# EAGLE design Beagle Cape (EAGLE 5.11)
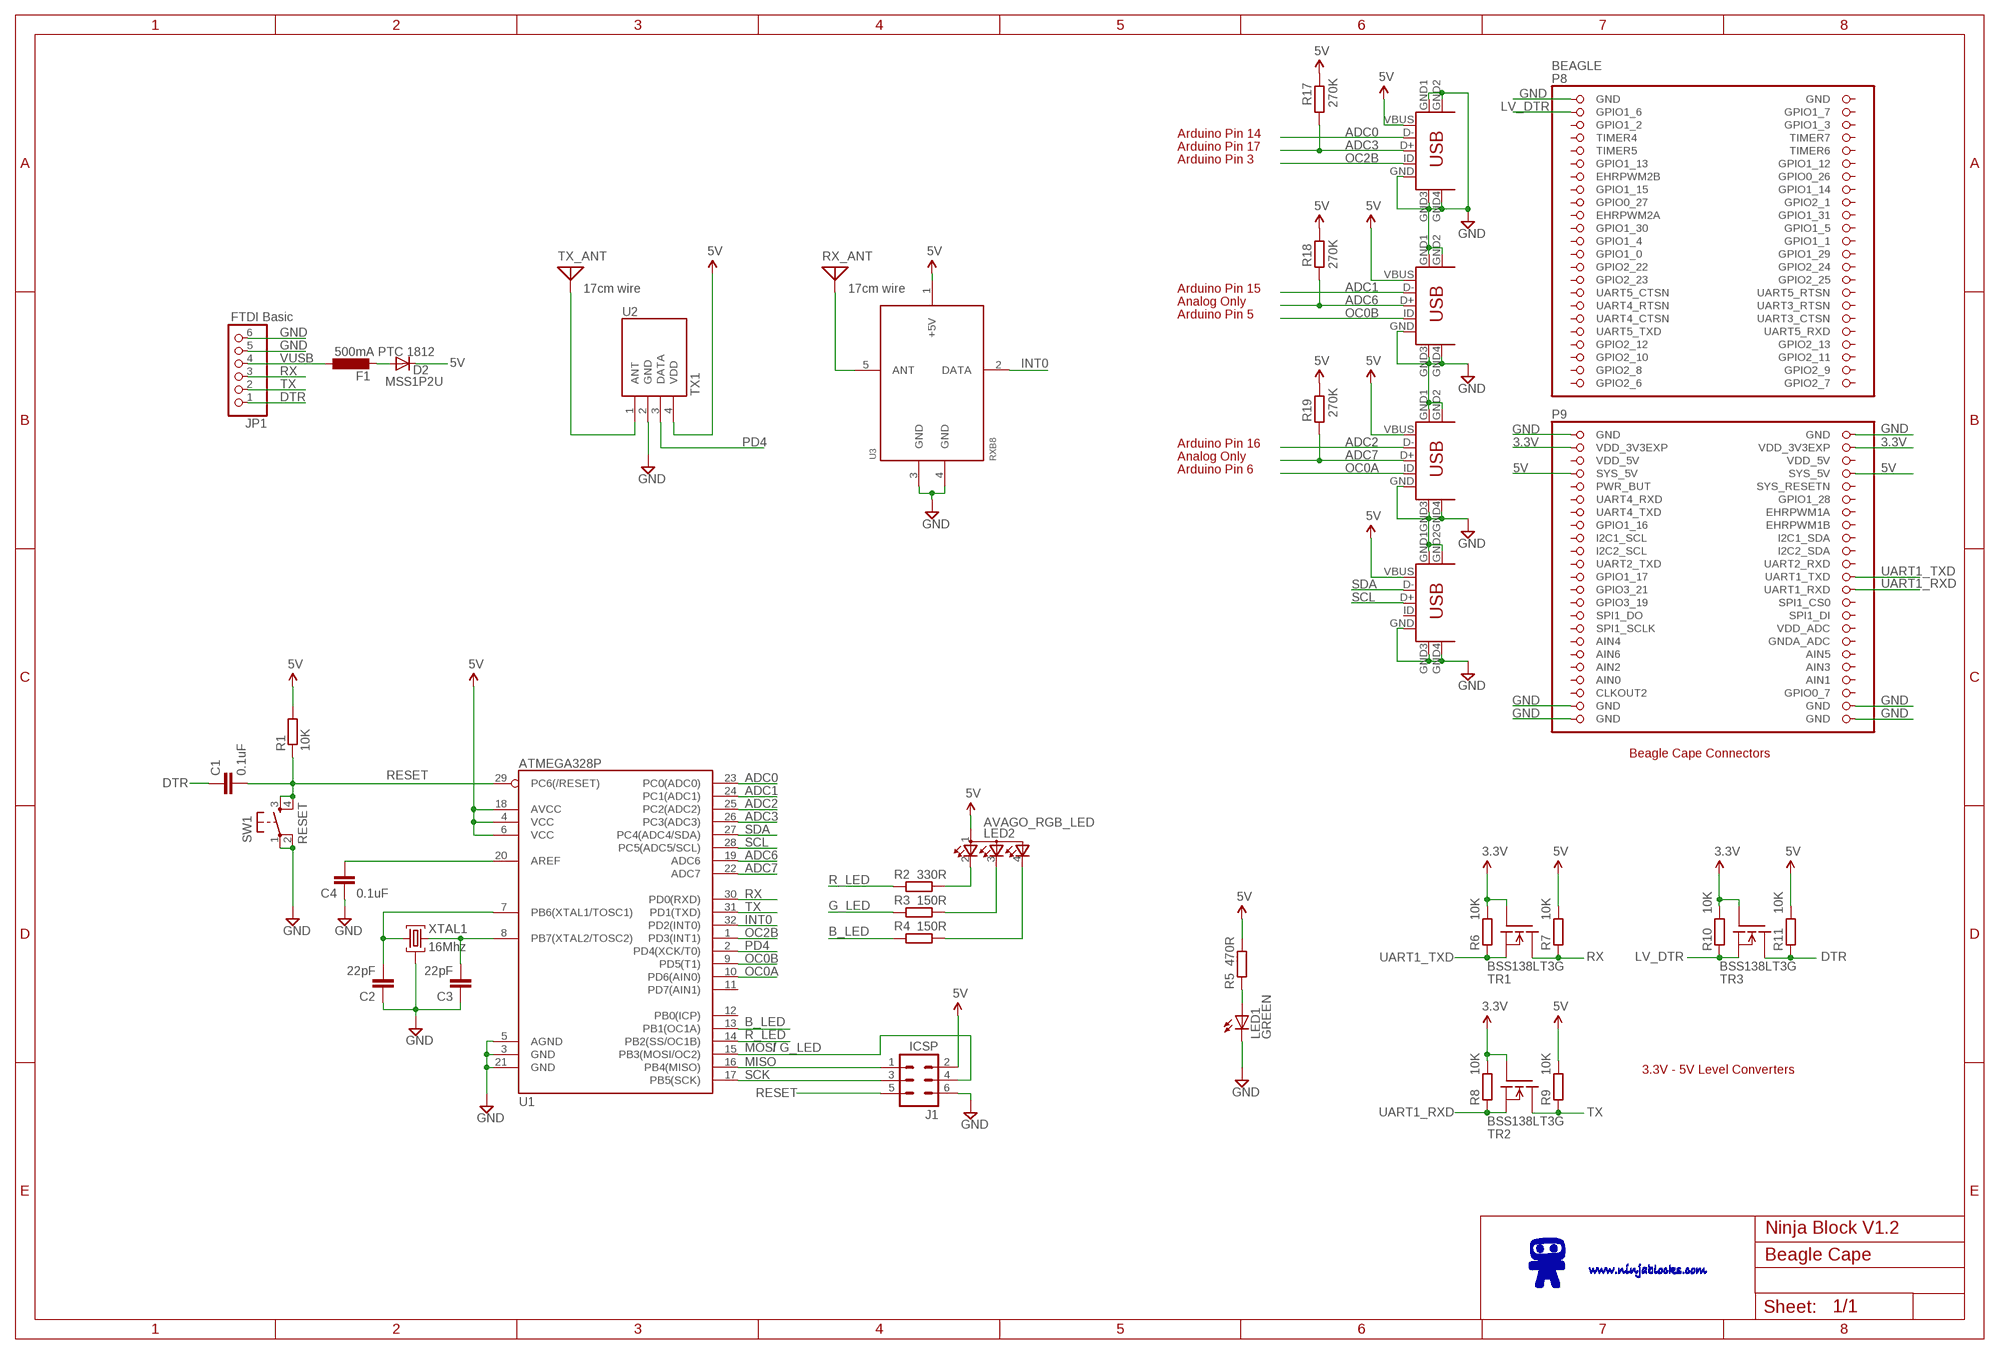
[diagram p0: schematic, sheet 1]

## Parts
BEAGLE  BEAGLEBONE_OUTLINE  [BEAGLEBONE_SHIELD]
C1  0.1uF  C-EUC0603  [C0603]
C2  22pF  C-EUC0603  [C0603]
C3  22pF  C-EUC0603  [C0603]
C4  0.1uF  C-EUC0603  [C0603]
CON1  USB-MINIB  [MOLEX_MINIUSB_B]
CON2  USB-MINIB  [MOLEX_MINIUSB_B]
CON3  USB-MINIB  [MOLEX_MINIUSB_B]
D2  MSS1P2U  [MICROSMP]
F1  500mA PTC 1812  L-EUL1812  [L1812]
I2C  USB-MINIB  [MOLEX_MINIUSB_B]
J1  ICSP  MA03-2  [MA03-2]
JP1  FTDI Basic  PINHD-1X6  [1X06]
LED1  GREEN  LEDCHIPLED_0603  [CHIPLED_0603]
LED2  AVAGO_RGB_LED  [AVAGO_LED]
R1  10K  R-EU_R0603  [R0603]
R2  330R  R-EU_R0603  [R0603]
R3  150R  R-EU_R0603  [R0603]
R4  150R  R-EU_R0603  [R0603]
R5  470R  R-EU_R0603  [R0603]
R6  10K  R-EU_R0603  [R0603]
R7  10K  R-EU_R0603  [R0603]
R8  10K  R-EU_R0603  [R0603]
R9  10K  R-EU_R0603  [R0603]
R10  10K  R-EU_R0603  [R0603]
R11  10K  R-EU_R0603  [R0603]
R17  270K  R-EU_R0603  [R0603]
R18  270K  R-EU_R0603  [R0603]
R19  270K  R-EU_R0603  [R0603]
RX_ANT  17cm wire  ANTENNA  [PAD-01]
SW1  RESET  ALPS_SMD_TAC_SWITCH  [ALPS_SMD_TAC_SWITCH]
TR1  BSS138LT3G  IRLML2502PBF  [SOT23]
TR2  BSS138LT3G  IRLML2502PBF  [SOT23]
TR3  BSS138LT3G  IRLML2502PBF  [SOT23]
TX_ANT  17cm wire  ANTENNA  [PAD-01]
U1  ATMEGA328P  ATMEGA168  [TQFP32-08]
U2  TX1  [TX1]
U3  RXB8  [RXB8]
XTAL1  16Mhz  12MHZ  [HC49US-G]

## Nets
3.3V: BEAGLE.49(VDD_3V3EXP) BEAGLE.50(VDD_3V3EXP) R6.1 R8.1 R10.1 TR1.1(G) TR2.1(G) TR3.1(G)
5V: BEAGLE.53(SYS_5V) BEAGLE.54(SYS_5V) CON1.VBUS CON2.VBUS CON3.VBUS D2.C I2C.VBUS J1.2 LED2.1(A1) R1.2 R5.1 R7.1 R9.1 R11.1 R17.1 R18.1 R19.1 U1.4(VCC) U1.6(VCC) U1.18(AVCC) U2.4(VDD) U3.1(+5V)
ADC0: CON1.D- U1.23(PC0(ADC0))
ADC1: CON2.D- U1.24(PC1(ADC1))
ADC2: CON3.D- U1.25(PC2(ADC2))
ADC3: CON1.D+ R17.2 U1.26(PC3(ADC3))
ADC6: CON2.D+ R18.2 U1.19(ADC6)
ADC7: CON3.D+ R19.2 U1.22(ADC7)
B_LED: R4.2 U1.13(PB1(OC1A))
DTR: C1.1 JP1.1 R11.2 TR3.3(D)
GND: BEAGLE.1(GND) BEAGLE.47(GND) BEAGLE.48(GND) BEAGLE.89(GND) BEAGLE.90(GND) BEAGLE.91(GND) BEAGLE.92(GND) C2.1 C3.1 C4.1 CON1.GND CON1.GND1(MTN1) CON1.GND2(MTN2) CON1.GND3(MTN3) CON1.GND4(MTN4) CON2.GND CON2.GND1(MTN1) CON2.GND2(MTN2) CON2.GND3(MTN3) CON2.GND4(MTN4) CON3.GND CON3.GND1(MTN1) CON3.GND2(MTN2) CON3.GND3(MTN3) CON3.GND4(MTN4) I2C.GND I2C.GND1(MTN1) I2C.GND2(MTN2) I2C.GND3(MTN3) I2C.GND4(MTN4) J1.6 JP1.5 JP1.6 LED1.C SW1.1 SW1.2 U1.3(GND) U1.5(AGND) U1.21(GND) U2.2(GND) U3.3(GND) U3.4(GND) XTAL1.GND
INT0: U1.32(PD2(INT0)) U3.2(DATA)
LV_DTR: BEAGLE.3(GPIO1_6) R10.2 TR3.2(S)
MISO: J1.1 U1.16(PB4(MISO))
MOSI: J1.4 R3.2 U1.15(PB3(MOSI/OC2))
N$1: C2.2 U1.7(PB6(XTAL1/TOSC1)) XTAL1.1
N$2: LED2.2(R2) R2.1
N$3: C3.2 U1.8(PB7(XTAL2/TOSC2)) XTAL1.2
N$4: C4.2 U1.20(AREF)
N$5: LED2.3(G3) R3.1
N$6: LED2.4(B4) R4.1
N$7: TX_ANT.1 U2.1(ANT)
N$8: RX_ANT.1 U3.5(ANT)
N$9: LED1.A R5.2
N$16: D2.A F1.2
OC0A: CON3.ID U1.10(PD6(AIN0))
OC0B: CON2.ID U1.9(PD5(T1))
OC2B: CON1.ID U1.1(PD3(INT1))
PD4: U1.2(PD4(XCK/T0)) U2.3(DATA)
R_LED: R2.2 U1.14(PB2(SS/OC1B))
RESET: C1.2 J1.5 R1.1 SW1.3 SW1.4 U1.29(PC6(/RESET))
RX: JP1.3 R7.2 TR1.3(D) U1.30(PD0(RXD))
SCK: J1.3 U1.17(PB5(SCK))
SCL: I2C.D+ U1.28(PC5(ADC5/SCL))
SDA: I2C.D- U1.27(PC4(ADC4/SDA))
TX: JP1.2 R9.2 TR2.3(D) U1.31(PD1(TXD))
UART1_RXD: BEAGLE.72(UART1_RXD) R8.2 TR2.2(S)
UART1_TXD: BEAGLE.70(UART1_TXD) R6.2 TR1.2(S)
VUSB: F1.1 JP1.4
Unconnected: BEAGLE.5(GPIO1_2) BEAGLE.6(GPIO1_3) BEAGLE.7(TIMER4) BEAGLE.8(TIMER7) BEAGLE.9(TIMER5) BEAGLE.10(TIMER6) BEAGLE.11(GPIO1_13) BEAGLE.12(GPIO1_12) BEAGLE.13(EHRPWM2B) BEAGLE.14(GPIO0_26) BEAGLE.15(GPIO1_15) BEAGLE.16(GPIO1_14) BEAGLE.17(GPIO0_27) BEAGLE.18(GPIO2_1) BEAGLE.19(EHRPWM2A) BEAGLE.20(GPIO1_31) BEAGLE.21(GPIO1_30) BEAGLE.22(GPIO1_5) BEAGLE.23(GPIO1_4) BEAGLE.24(GPIO1_1) BEAGLE.25(GPIO1_0) BEAGLE.26(GPIO1_29) BEAGLE.27(GPIO2_22) BEAGLE.28(GPIO2_24) BEAGLE.29(GPIO2_23) BEAGLE.30(GPIO2_25) BEAGLE.31(UART5_CTSN) BEAGLE.32(UART5_RTSN) BEAGLE.33(UART4_RTSN) BEAGLE.34(UART3_RTSN) BEAGLE.35(UART4_CTSN) BEAGLE.36(UART3_CTSN) BEAGLE.37(UART5_TXD) BEAGLE.38(UART5_RXD) BEAGLE.39(GPIO2_12) BEAGLE.40(GPIO2_13) BEAGLE.41(GPIO2_10) BEAGLE.55(PWR_BUT) BEAGLE.56(SYS_RESETN) BEAGLE.57(UART4_RXD) BEAGLE.58(GPIO1_28) BEAGLE.59(UART4_TXD) BEAGLE.60(EHRPWM1A) BEAGLE.61(GPIO1_16) BEAGLE.62(EHRPWM1B) BEAGLE.63(I2C1_SCL) BEAGLE.64(I2C1_SDA) BEAGLE.65(I2C2_SCL) BEAGLE.66(I2C2_SDA) BEAGLE.67(UART2_TXD) BEAGLE.68(UART2_RXD) BEAGLE.69(GPIO1_17) BEAGLE.71(GPIO3_21) BEAGLE.73(GPIO3_19) BEAGLE.74(SPI1_CS0) BEAGLE.75(SPI1_DO) BEAGLE.76(SPI1_DI) BEAGLE.77(SPI1_SCLK) BEAGLE.78(VDD_ADC) BEAGLE.79(AIN4) BEAGLE.80(GNDA_ADC) BEAGLE.81(AIN6) BEAGLE.82(AIN5) BEAGLE.83(AIN2) BEAGLE.86(AIN1) BEAGLE.87(CLKOUT2) BEAGLE.88(GPIO0_7) I2C.ID U1.11(PD7(AIN1)) U1.12(PB0(ICP))

## Notes on the sheet
- Arduino Pin 14
- Arduino Pin 17
- Arduino Pin 3
- Arduino Pin 15
- Analog Only
- Arduino Pin 5
- Arduino Pin 16
- Analog Only
- Arduino Pin 6
- Beagle Cape Connectors
- G_LED
- / G_LED
- 3.3V - 5V Level Converters
- Ninja Block V1.2

## Power pins joined to a net without a drawn wire
AIN0: BEAGLE.85(AIN0)
AIN3: BEAGLE.84(AIN3)
GND: BEAGLE.2(GND)
GPIO1_7: BEAGLE.4(GPIO1_7)
GPIO2_6: BEAGLE.45(GPIO2_6)
GPIO2_7: BEAGLE.46(GPIO2_7)
GPIO2_8: BEAGLE.43(GPIO2_8)
GPIO2_9: BEAGLE.44(GPIO2_9)
GPIO2_11: BEAGLE.42(GPIO2_11)
VDD_5V: BEAGLE.51(VDD_5V) BEAGLE.52(VDD_5V)

## Library data of the parts
BEAGLE = adafruit:BEAGLEBONE_OUTLINE: Should match A3 pinout - but not completely tested
C1-C4 = rcl:C-EU: CAPACITOR, European symbol
CON1-CON3 I2C = SparkFun:USB-MINIB: Mini-USB "B" connector with 5th pin broken out. Created new symbol breaking out 5th "ID" pin in mini/micro USB connector spec. See: http://en.wikipedia.org/wiki/Mini_usb#Cables. Uses same footprint as 4-pin symbol. Also added pins to connect to mounting / shield pads if required (probably not generally needed as signals aren't shielded once they leave the connector).
D2 = Monkey:MSS1P2U: MSS1P2U-M3/89A Schottky Rectifier Datasheet : http://www.vishay.com/docs/89020/mss1p3l.pdf
F1 = rcl:L-EU: INDUCTOR, European symbol
J1 = con-lstb:MA03-2: PIN HEADER; OC_FARNELL: unknown; OC_NEWARK: unknown
JP1 = pinhead:PINHD-1X6: PIN HEADER
LED1 = led:LED: LED OSRAM: - CHIPLED LG R971, LG N971, LY N971, LG Q971, LY Q971, LO R971, LY R971 LH N974, LH R974 LS Q976, LO Q976, LY Q976 LO Q996 - Hyper CHIPLED LW Q18S LB Q993, LB Q99A, LB R99A - SideLED LS A670, LO A670, LY A670, LG A670, LP A670 LB A673, LV A673, LT A673, LW A673 LH A674 LY A675 LS A676, LA A676, LO A676, LY A676, LW A676 LS A679, LY A679, LG A679 - Hyper Micro SIDELED® LS Y876, LA Y876, LO Y876, LY Y876 LT Y87S - SmartLED LW L88C, LW L88S LB L89C, LB L89S, LG L890 LS L89K, LO L89K, LY L89K LS L896, LA L896, LO L896, LY L896 - TOPLED LS T670, LO T670, LY T670, LG T670, LP T670 LSG T670, LSP T670, LSY T670, LOP T670, LYG T670 LG T671, LOG T671, LSG T671 LB T673, LV T673, LT T673, LW T673 LH T674 LS T676, LA T676, LO T676, LY T676, LB T676, LH T676, LSB T676, LW T676 LB T67C, LV T67C, LT T67C, LS T67K, LO T67K, LY T67K, LW E67C LS E67B, LA E67B, LO E67B, LY E67B, LB E67C, LV E67C, LT E67C LW T67C LS T679, LY T679, LG T679 LS T770, LO T770, LY T770, LG T770, LP T770 LB T773, LV T773, LT T773, LW T773 LH T774 LS E675, LA E675, LY E675, LS T675 LS T776, LA T776, LO T776, LY T776, LB T776 LHGB T686 LT T68C, LB T68C - Hyper Mini TOPLED® LB M676 - Mini TOPLED Santana® LG M470 LS M47K, LO M47K, LY M47K Source: http://www.osram.convergy.de LUXEON: - LUMILED® LXK2-PW12-R00, LXK2-PW12-S00, LXK2-PW14-U00, LXK2-PW14-V00 LXK2-PM12-R00, LXK2-PM12-S00, LXK2-PM14-U00 LXK2-PE12-Q00, LXK2-PE12-R00, LXK2-PE12-S00, LXK2-PE14-T00, LXK2-PE14-U00 LXK2-PB12-K00, LXK2-PB12-L00, LXK2-PB12-M00, LXK2-PB14-N00, LXK2-PB14-P00, LXK2-PB14-Q00 LXK2-PR12-L00, LXK2-PR12-M00, LXK2-PR14-Q00, LXK2-PR14-R00 LXK2-PD12-Q00, LXK2-PD12-R00, LXK2-PD12-S00 LXK2-PH12-R00, LXK2-PH12-S00 LXK2-PL12-P00, LXK2-PL12-Q00, LXK2-PL12-R00 Source: www.luxeon.com KINGBRIGHT: KA-3528ASYC Source: www.kingbright.com
LED2 = Monkey:AVAGO_RGB_LED
R1-R11 R17-R19 = resistor:R-EU_: RESISTOR, European symbol
RX_ANT TX_ANT = discrete:ANTENNA: Antenna
SW1 = Monkey:ALPS_SMD_TAC_SWITCH: ALPS SMD Tactile Switch SKQGAKE010 Source : http://www.farnell.com/datasheets/78970.pdf
TR1-TR3 = Monkey:IRLML2502PBF: IRLML2502 N-Channel HexFet Power Mosfet Datasheet : http://www.irf.com/product-info/datasheets/data/irlml2502pbf.pdf
U1 = SparkFun:ATMEGA168
U2 = ninja:TX1
U3 = ninja:RXB8: RY-RXB8 ASK Receiving module http://www.relyrf.com/rf/ask_receiver/RY-RXB8.htm
XTAL1 = Monkey:12MHZ: HC/49US (AT49) 3RD LEAD CASE-GROUNDED SMD LOW PROFILE CRYSTAL CRYSTAL, 12MHz, 18pF, HC-49/US Source : http://www.abracon.com/Resonators/ABLSG.pdf

## Board
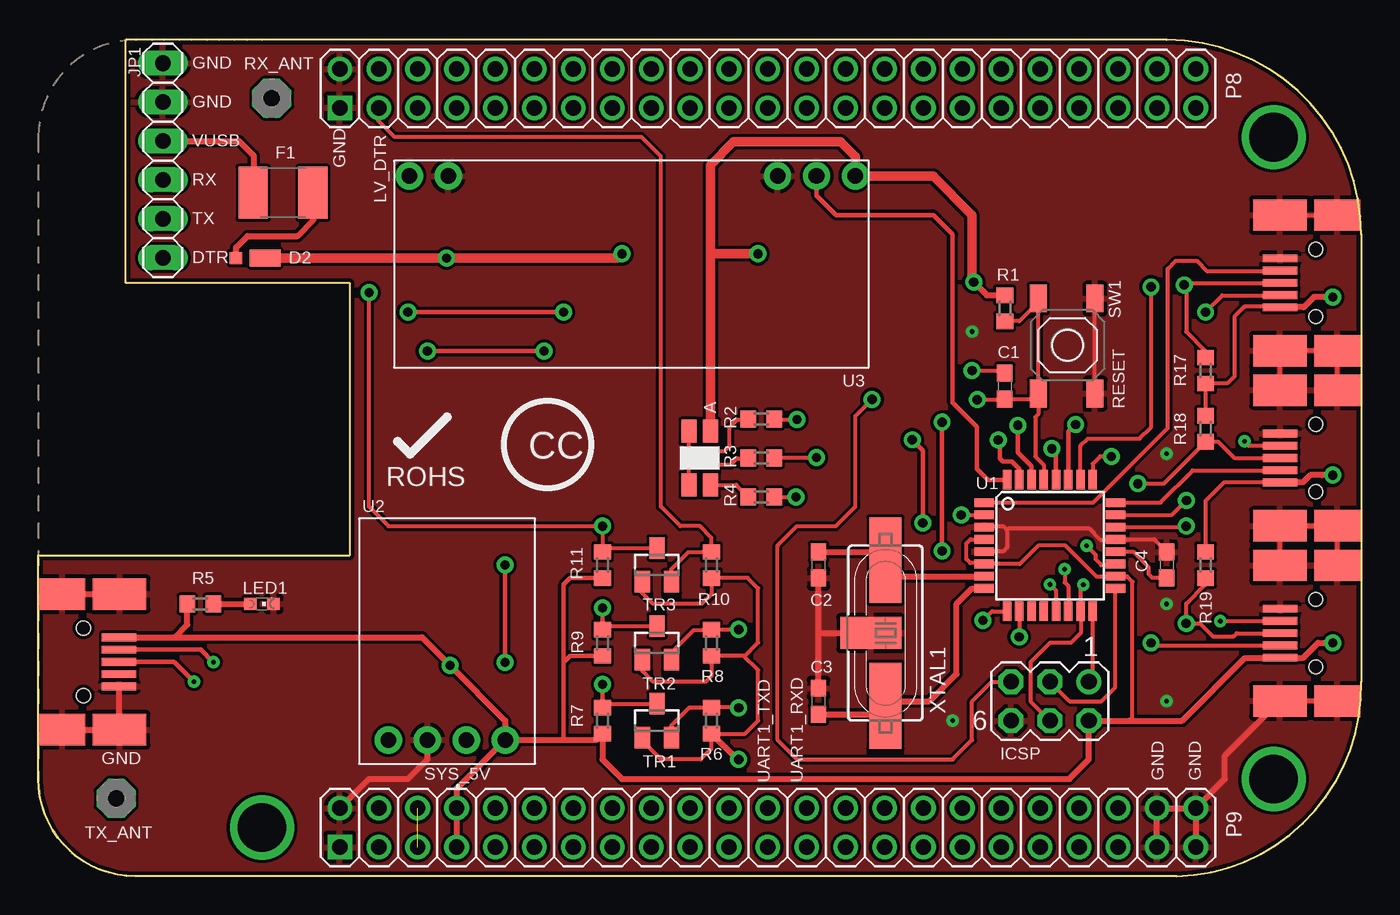
[diagram p1: board, top side]
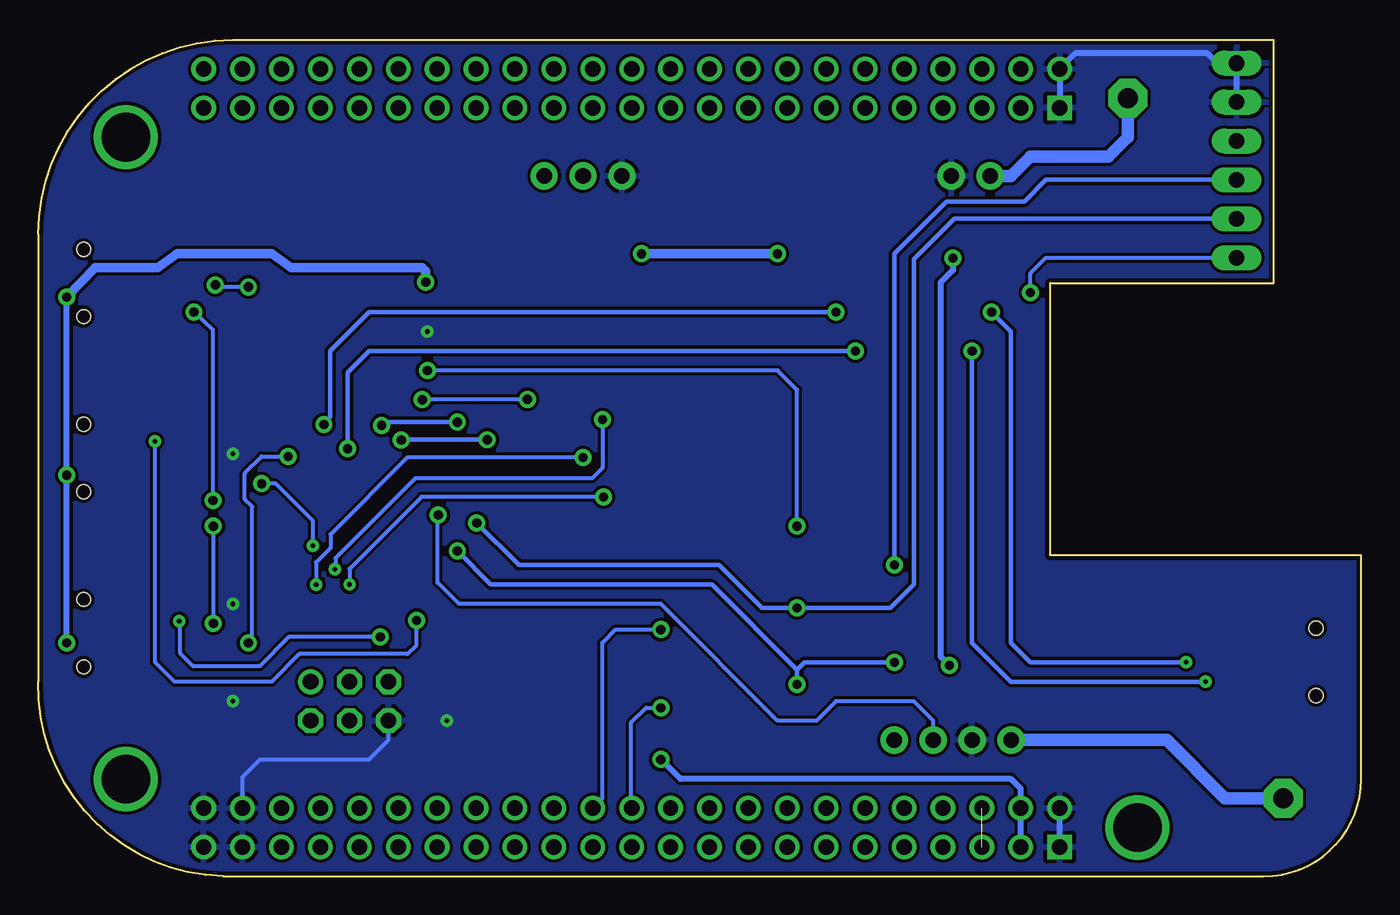
[diagram p2: board, bottom side, seen from below]

Size 86.36 x 54.61 mm. Coordinates in mm from the lower left corner, seen from the top.
Copper layers (1*16): Top 0.035mm / dielectric 1.5mm / Bottom 0.035mm
Design rules "SparkFun": minimum track width 8mil, minimum drill 20mil, track to track 8mil, track to pad 8mil, pad to pad 8mil, via to via 8mil, smd to smd 8mil, copper to edge 10mil, drill to drill 8mil, minimum pad ring 12mil, minimum via ring 10mil, stop-mask expansion 4mil, vias tented up to drill 25mil, thermal gap 10mil

### Footprints (pad centres in the part's own frame; a part is rotated, then mirrored left to right if it is on the bottom)
BEAGLEBONE_SHIELD = drill 1 square: 1 19.685,50.165; 47 19.685,1.905 | drill 1 round: 2 19.685,52.705; 3 22.225,50.165; 4 22.225,52.705; 5 24.765,50.165; 6 24.765,52.705; 7 27.305,50.165; 8 27.305,52.705; 9 29.845,50.165; 10 29.845,52.705; 11 32.385,50.165; 12 32.385,52.705; 13 34.925,50.165; 14 34.925,52.705; 15 37.465,50.165; 16 37.465,52.705; 17 40.005,50.165; 18 40.005,52.705; 19 42.545,50.165; 20 42.545,52.705; 21 45.085,50.165; 22 45.085,52.705; 23 47.625,50.165; 24 47.625,52.705; 25 50.165,50.165; 26 50.165,52.705; 27 52.705,50.165; 28 52.705,52.705; 29 55.245,50.165; 30 55.245,52.705; 31 57.785,50.165; 32 57.785,52.705; 33 60.325,50.165; 34 60.325,52.705; 35 62.865,50.165; 36 62.865,52.705; 37 65.405,50.165; 38 65.405,52.705; 39 67.945,50.165; 40 67.945,52.705; 41 70.485,50.165; 42 70.485,52.705; 43 73.025,50.165; 44 73.025,52.705; 45 75.565,50.165; 46 75.565,52.705; 48 19.685,4.445; 49 22.225,1.905; 50 22.225,4.445; 51 24.765,1.905; 52 24.765,4.445; 53 27.305,1.905; 54 27.305,4.445; 55 29.845,1.905; 56 29.845,4.445; 57 32.385,1.905; 58 32.385,4.445; 59 34.925,1.905; 60 34.925,4.445; 61 37.465,1.905; 62 37.465,4.445; 63 40.005,1.905; 64 40.005,4.445; 65 42.545,1.905; 66 42.545,4.445; 67 45.085,1.905; 68 45.085,4.445; 69 47.625,1.905; 70 47.625,4.445; 71 50.165,1.905; 72 50.165,4.445; 73 52.705,1.905; 74 52.705,4.445; 75 55.245,1.905; 76 55.245,4.445; 77 57.785,1.905; 78 57.785,4.445; 79 60.325,1.905; 80 60.325,4.445; 81 62.865,1.905; 82 62.865,4.445; 83 65.405,1.905; 84 65.405,4.445; 85 67.945,1.905; 86 67.945,4.445; 87 70.485,1.905; 88 70.485,4.445; 89 73.025,1.905; 90 73.025,4.445; 91 75.565,1.905; 92 75.565,4.445 | drill 3.175 round: P$1 14.605,3.175; P$2 80.645,6.35; P$3 80.645,48.26
C0603 = smd 1.1 x 1: 1 -0.85,0; 2 0.85,0
MOLEX_MINIUSB_B = smd 2.25 x 0.5: D+ 2.325,-0.005; D- 2.325,0.795; GND 2.325,-1.605; ID 2.325,-0.805; VBUS 2.325,1.595 | smd 3 x 2.05: GND1 -1.4,-4.43; GND3 -1.4,4.42 | smd 3.5 x 2.05: GND2 2.35,-4.43; GND4 2.35,4.42 | hole 0.9: 0,-2.205; 0,2.195
MICROSMP = smd 0.8 x 0.8: A 1.9,0 | smd 2 x 1.1: C 0,0
L1812 = smd 1.9 x 3.4: 1 -1.95,0; 2 1.95,0
MA03-2 = drill 1.016 round: 1 -2.54,-1.27 | drill 1.016 octagon: 2 -2.54,1.27; 3 0,-1.27; 4 0,1.27; 5 2.54,-1.27; 6 2.54,1.27
1X06 = drill 1.016 long: 1 -6.35,0; 2 -3.81,0; 3 -1.27,0; 4 1.27,0; 5 3.81,0; 6 6.35,0
CHIPLED_0603 = smd 0.8 x 0.8: A 0,-0.75; C 0,0.75
AVAGO_LED = smd 1.5 x 1: 1 1.75,-0.7; 2 1.75,0.7; 3 -1.75,0.7; 4 -1.75,-0.7
R0603 = smd 1 x 1.1: 1 -0.85,0; 2 0.85,0
PAD-01 = drill 1.321 pad 2.54 octagon: 1 0,0
ALPS_SMD_TAC_SWITCH = smd 1.8 x 1.1: 1 0,3.7; 2 6.2,3.7; 3 0,0; 4 6.2,0
SOT23 = smd 1 x 1.4: 1 -0.95,-1.1; 2 0.95,-1.1; 3 0,1.1
TQFP32-08 = smd 1.27 x 0.559: 1 -4.293,2.8; 2 -4.293,2; 3 -4.293,1.2; 4 -4.293,0.4; 5 -4.293,-0.4; 6 -4.293,-1.2; 7 -4.293,-2; 8 -4.293,-2.8; 17 4.293,-2.8; 18 4.293,-2; 19 4.293,-1.2; 20 4.293,-0.4; 21 4.293,0.4; 22 4.293,1.2; 23 4.293,2; 24 4.293,2.8 | smd 0.559 x 1.27: 9 -2.8,-4.293; 10 -2,-4.293; 11 -1.2,-4.293; 12 -0.4,-4.293; 13 0.4,-4.293; 14 1.2,-4.293; 15 2,-4.293; 16 2.8,-4.293; 25 2.8,4.293; 26 2,4.293; 27 1.2,4.293; 28 0.4,4.293; 29 -0.4,4.293; 30 -1.2,4.293; 31 -2,4.293; 32 -2.8,4.293
TX1 = drill 1.016 pad 1.778 round: 1 0,0; 2 2.54,0; 3 5.08,0; 4 7.62,0
RXB8 = drill 1.016 pad 1.778 round: 1 -24.13,0; 2 -21.59,0; 3 -19.05,0; 4 2.45,0; 5 4.99,0
HC49US-G = smd 5.6 x 2.1: 1 -11.74,0.95; 2 -2.24,0.95 | smd 2.1 x 4: GND -6.99,0

### Placement (x,y rotation side)
BEAGLE  0,0 0 top
C1  63.09,32 270 top
C2  50.93,20.32 90 top
C3  50.93,11.43 270 top
C4  73.66,20.32 270 top
CON1  83.4,38.73 180 top
CON2  83.4,27.3 180 top
CON3  83.4,15.87 180 top
D2  14.81,40.36 180 top
F1  15.98,44.63 0 top
I2C  2.95,14 0 top
J1  66.04,11.43 180 top
JP1  8.13,46.74 90 top
LED1  14.61,17.78 270 top
LED2  43.18,27.3 90 top
R1  63.09,37.08 90 top
R2  47.19,29.84 0 top
R3  47.19,27.3 0 top
R4  47.19,24.77 0 top
R5  10.58,17.78 0 top
R6  43.94,10.16 90 top
R7  36.83,10.16 90 top
R8  43.94,15.24 90 top
R9  36.83,15.24 90 top
R10  43.94,20.32 90 top
R11  36.83,20.32 90 top
R17  76.2,33.02 90 top
R18  76.2,29.21 270 top
R19  76.2,20.32 270 top
RX_ANT  15.24,50.8 0 top
SW1  65.28,37.72 270 top
TR1  40.39,10.16 0 top
TR2  40.39,15.24 0 top
TR3  40.39,20.32 0 top
TX_ANT  5.08,5.08 0 top
U1  66.04,21.59 0 top
U2  22.86,8.89 0 top
U3  29.21,45.72 180 top
XTAL1  54.36,8.89 270 top

### Tracks (layer width: path | path; a pad name or v marks a point on that pad's centre or on a via)
3.3V  (via drill 0.6)
  Top 0.254: TR3.1 39.44,19.12 39.37,19.05 39.37,18.54 40.13,17.78 43.31,17.78 43.94,18.41 R10.1 43.95,19.48 46.3,19.48 46.99,18.8 46.99,15.27 46.13,14.4 46.05,14.4 | TR2.1 39.44,13.4 40.13,12.7 43.56,12.7 43.94,13.08 43.94,13.89 44.45,14.4 | TR1.1 39.44,8.82 40.64,7.62 43.23,7.62 43.92,8.31 43.92,9.29 R6.1 46.14,9.31 46.99,10.16 46.99,13.46 46.05,14.4 | 46.05,14.4 44.45,14.4 | 44.45,14.4 43.95,14.4 R8.1
  Top 0.406: v45.72,7.62 45.63,7.62 R6.1
  Bottom 0.406: BEAGLE.49 BEAGLE.50 22.23,5.71 22.86,6.35 44.45,6.35 v45.72,7.62
5V  (via drill 0.6)
  Top 0.254: U1.4 60.85,21.99 60.58,21.72 60.58,20.7 60.83,20.45 61.69,20.45 U1.6 64.08,20.39 65.28,21.59 67.06,21.59 69.09,19.56 70.3,19.56 U1.18 71.07,19.58 71.42,19.23 71.42,10.21 71.2,10.16 | CON1.VBUS | CON1.VBUS | v61.06,38.79 60.96,38.89 | R18.1 R17.1 77.61,32.17 78.08,32.64 78.08,36.52 78.74,37.19 81.03,37.19 CON1.VBUS | CON2.VBUS 77.39,25.7 76.2,24.51 R19.1
  Top 0.305: R11.1 34.71,19.47 34.29,19.05 34.29,13.97 | 34.29,8.89 34.29,13.97 | R9.1 34.71,14.39 34.29,13.97
  Top 0.406: BEAGLE.53 BEAGLE.54 27.3,5.71 U2.4 | 81.13,25.7 CON2.VBUS 82.56,25.71 83.04,26.19 83.79,26.19 v84.5,26.19 | CON1.VBUS 81.05,37.13 | R1.2 61.91,37.93 v61.06,38.79 | v84.5,37.82 83.27,37.82 82.6,37.15 CON1.VBUS | v84.5,15.24 83.55,15.24 82.58,14.27 CON3.VBUS 81.05,14.25 78.77,14.25 74.68,10.16 71.2,10.16 J1.2 68.58,7.62 67.31,6.35 38.1,6.35 36.83,7.62 R7.1 36.41,8.89 34.29,8.89 U2.4 | I2C.VBUS 8.89,15.6 | 8.89,15.6 25.05,15.6 v26.87,13.77 | v26.87,13.77 30.48,10.16 U2.4 | R5.1 9.73,16.43 8.89,15.6 | 26.9,13.79 v26.87,13.77
  Top 0.61: 60.96,38.89 60.96,43.18 58.42,45.72 U3.1 53.34,46.99 52.35,47.95 45.39,47.95 43.88,46.42 43.88,40.64 | 43.88,40.64 LED2.1 | D2.C v26.64,40.36 37.82,40.36 v38.1,40.64 | 43.88,40.64 v46.99,40.64
  Bottom 0.406: v84.5,37.82 v84.5,26.19 v84.5,15.24 | v26.64,40.36 26.64,39.57 27.46,38.76 27.46,14.35 26.9,13.79
  Bottom 0.61: v61.06,38.79 61.06,39.5 61.29,39.73 69.85,39.73 71.12,40.64 77.29,40.64 78.56,39.73 82.65,39.73 v84.5,37.82 | v46.99,40.64 v38.1,40.64
ADC0  (via drill 0.6)
  Top 0.254: U1.23 74.01,23.59 v74.95,24.54 | CON1.D- 81.06,37.92 77.29,37.92 v76.2,36.83
  Bottom 0.254: v74.95,24.54 74.95,35.66 v76.2,36.83
ADC1
  Top 0.254: U1.24 73.26,24.39 75.36,26.49 81.06,26.49 CON2.D-
ADC2  (via drill 0.6)
  Top 0.254: v70.05,27.41 69.32,27.41 68.83,26.92 U1.25 | CON3.D- 72.81,15.07 v72.64,15.24
  Bottom 0.254: v70.05,27.41 71.78,27.41 72.87,26.31 72.87,24.61 72.39,24.13 72.39,15.49 v72.64,15.24
ADC3  (via drill 0.6)
  Top 0.254: v72.64,38.48 72.64,29.34 71.88,28.57 68.5,28.57 68.04,28.11 U1.26 | CON1.D+ 74.94,38.74 v74.8,38.61 74.93,38.48 74.93,35.56 76.2,34.29 R17.2
  Bottom 0.254: v72.64,38.48 74.68,38.48 v74.8,38.61
ADC6  (via drill 0.3, 0.6)
  Top 0.254: R18.2 76.22,28.34 | R18.2 76.17,28.34 | R18.2 76.19,28.37 | U1.19 69.92,20.39 69.85,20.32 69.39,20.32 69.01,20.7 69.01,21.01 v68.43,21.59 | v71.78,25.63 73.47,25.63 R18.2 | CON2.D+ 78.08,27.31 77.01,28.37 76.21,28.37 R18.2
  Bottom 0.254: v68.43,21.59 68.43,23.19 70.87,25.63 v71.78,25.63
ADC7  (via drill 0.6)
  Top 0.254: CON3.D+ 78.23,15.87 78.03,15.67 76.66,15.67 75.82,16.51 v74.93,16.51 74.93,17.78 76.2,19.05 R19.2 | U1.22 74.86,22.79 v74.93,22.86
  Bottom 0.254: v74.93,22.86 v74.93,16.51
B_LED  (via drill 0.3, 0.6)
  Top 0.254: U1.13 66.44,18.65 v66.04,19.05 | R4.2 v49.45,24.77
  Bottom 0.254: v49.45,24.77 61.34,24.77 66.04,20.07 v66.04,19.05
DTR  (via drill 0.6)
  Top 0.254: TR3.3 37.08,21.42 R11.2 v36.83,22.86 22.86,22.86 21.59,24.13 v21.59,38.1 | v60.96,33.02 62.93,33.02 C1.1
  Bottom 0.254: v36.83,22.86 36.83,31.75 38.1,33.02 v60.96,33.02 | JP1.1 20.57,40.39 21.59,39.37 v21.59,38.1
GND  (via drill 0.3)
  Top 0.254: SW1.2 SW1.1 | U1.3 62.16,22.79 62.23,22.86 62.99,22.86 63.25,22.61 | 63.25,22.61 63.25,21.46 62.99,21.21 61.77,21.21 U1.5 | 63.25,22.61 63.37,22.73 68.58,22.73 69.34,21.97 70.31,21.97 U1.21 72.84,21.99 C4.1 | CON1.GND2 CON1.GND1
  Top 0.305: CON3.GND2 CON2.GND4 CON2.GND3 CON3.GND1 | CON3.GND4 CON3.GND3 | CON2.GND1 CON1.GND3 CON1.GND4 CON2.GND2
  Top 0.406: C3.1 50.93,15.88 | 50.93,15.88 C2.1 | XTAL1.GND 50.93,15.88 | BEAGLE.89 BEAGLE.90 BEAGLE.92 | BEAGLE.92 BEAGLE.91 | I2C.GND1 I2C.GND2 5.28,9.57 I2C.GND 5.25,12.38 | I2C.GND3 I2C.GND4 | BEAGLE.92 77.47,6.35 77.47,7.87 CON3.GND4 | U2.2 25.4,7.62 24.13,6.35 21.59,6.35 BEAGLE.48
  Bottom 0.254: J1.6 63.5,8.89 64.77,7.62 71.88,7.62 73.03,6.48 BEAGLE.90
  Bottom 0.406: BEAGLE.47 BEAGLE.48 | BEAGLE.1 BEAGLE.2 18.67,53.72 10.03,53.72 9.4,53.09 JP1.6 JP1.5
  other vias: 73.66,11.43 73.66,17.78 60.96,35.56 59.69,10.16 73.66,27.58
  pour Top: -5.08,58.42 -5.08,-5.08 88.9,-5.08 88.9,-3.81 88.9,58.42
  pour Bottom: -5.08,58.42 88.9,58.42 88.9,-5.08 -5.08,-5.08 -5.08,-2.54
INT0
  Top 0.305: U3.2 50.8,44.45 52.07,43.18 58.42,43.18 59.69,41.91 59.69,30.94 61.27,29.34 61.27,26.59 61.98,25.88 U1.32
LV_DTR
  Top 0.254: TR3.2 41.34,20.05 42.44,21.16 43.93,21.16 R10.2 43.94,22.1 43.18,22.86 41.91,22.86 40.64,24.13 40.64,46.99 39.37,48.26 23.27,48.26 22.2,49.33 22.2,50.14 BEAGLE.3
MISO
  Top 0.254: U1.16 68.84,12.96 J1.1
MOSI  (via drill 0.3, 0.6)
  Top 0.254: v50.8,27.33 48.07,27.33 R3.2 | J1.4 64.77,11.43 64.77,13.97 66.04,15.24 67.41,15.24 68.05,15.88 U1.15 68.04,18.84 v68.22,19.02
  Bottom 0.254: v50.8,27.33 62.28,27.33 67.28,22.33 67.28,21.44 68.22,20.5 v68.22,19.02
N$1
  Top 0.406: C2.2 54.77,21.17 XTAL1.1 55.37,20.56 55.37,19.56 55.4,19.59 U1.7
N$2
  Top 0.254: LED2.2 42.48,28.06 42.77,27.76 44.81,27.76 45.14,28.09 45.14,29.31 45.64,29.82 46.32,29.82 R2.1
N$3
  Top 0.406: C3.2 54.76,10.58 XTAL1.2 55.61,11.43 58.17,11.43 59.94,13.21 59.94,17.78 60.95,18.79 U1.8
N$4
  Top 0.254: U1.20 71.47,21.19 72.47,20.19 72.47,19.74 72.69,19.51 73.62,19.51 C4.2
N$5
  Top 0.254: LED2.3 42.48,26.66 42.7,26.87 45.21,26.87 45.62,27.28 46.32,27.28 R3.1
N$6
  Top 0.254: LED2.4 45.55,25.55 R4.1
N$7
  Bottom 0.813: U2.1 12.7,8.89 8.89,5.08 TX_ANT.1
N$8
  Bottom 0.813: U3.5 22.86,45.72 21.59,46.99 16.51,46.99 15.24,48.26 RX_ANT.1
N$9
  Top 0.406: R5.2 LED1.A
N$16
  Top 0.406: D2.A 12.91,41.05 13.66,41.81 16.92,41.81 17.96,42.85 17.96,44.6 F1.2
OC0A  (via drill 0.3, 0.6)
  Top 0.254: U1.10 64.04,15.88 v64.03,15.62 | v77.17,16.66 81.07,16.66 CON3.ID
  Bottom 0.254: v77.17,16.66 77.09,16.59 77.09,14.55 76.25,13.72 71.91,13.72 70,15.62 v64.03,15.62
OC0B  (via drill 0.3, 0.6)
  Top 0.254: U1.9 62.26,17.3 v61.67,16.71 | CON2.ID 81.07,28.12 79.02,28.12 v78.74,28.4
  Bottom 0.254: v61.67,16.71 61.67,15.09 62.26,14.5 69.32,14.5 71.12,12.7 77.47,12.7 78.74,13.97 v78.74,28.4
OC2B
  Top 0.254: CON1.ID 81.06,39.52 76.28,39.52 75.62,40.18 74.27,40.18 73.74,39.65 73.74,29.26 68.83,24.38 68.83,24.39 U1.1
PD4  (via drill 0.6)
  Top 0.254: U1.2 v60.26,23.59 v60.25,23.6
  Bottom 0.254: U2.3 27.94,10.16 29.21,11.43 34.29,11.43 35.56,10.16 38.1,10.16 45.72,17.78 58.9,17.78 60.3,19.18 60.3,23.55 v60.25,23.6
R_LED  (via drill 0.3, 0.6)
  Top 0.254: v49.53,29.82 48.07,29.82 R2.2 | U1.14 67.24,18.94 67,19.18 v67,20.04
  Bottom 0.254: v49.53,29.82 49.53,26.67 50.22,25.98 61.75,25.98 66.95,20.78 66.95,20.09 v67,20.04
RESET  (via drill 0.6)
  Top 0.254: SW1.4 SW1.3 | 65.27,31.15 SW1.4 | SW1.3 65.66,37.74 | SW1.3 65.28,37.49 64.03,36.25 63.1,36.25 R1.1 | 65.27,31.15 65.64,30.78 | 65.27,31.15 C1.2 63.05,31.11 v61.29,31.11 | U1.29 65.64,26.84 65.08,27.41 65.08,29.97 65.28,30.18 SW1.4 | J1.5 62.23,12.7 60.96,11.43 60.96,8.89 59.69,7.62 49.53,7.62 48.26,8.89 48.26,21.59 49.53,22.86 52.07,22.86 53.34,24.13 53.34,30.05 v54.43,31.14
  Bottom 0.254: v54.43,31.14 61.27,31.14 v61.29,31.11
RX  (via drill 0.6)
  Top 0.254: TR1.3 37.08,11.26 R7.2 | U1.30
  Top 0.305: v59,21.23 v59,29.64 | v30.48,13.97 v30.48,20.32 | v36.83,12.52 R7.2 | U1.30 64.84,26.78 63.96,27.66 v63.96,29.44
  Bottom 0.305: v59,21.23 56.82,19.05 42.39,19.05 36.83,13.49 | JP1.3 20.57,45.47 22,44.04 27.08,44.04 30.48,40.64 v30.48,20.32 | v30.48,13.97 36.35,13.97 36.83,13.49 | 36.83,13.49 v36.83,12.52 | v59,29.64 63.75,29.64 v63.96,29.44
SCK
  Top 0.254: J1.3 67.31,11.43 69.39,11.43 70.31,12.34 70.31,18.77 U1.17
SCL  (via drill 0.3, 0.6)
  Top 0.305: U1.28 66.44,27.54 v66.17,27.91 | v25.4,34.29 v33.02,34.29 | I2C.D+ 8.87,13.99 v10.16,12.7
  Bottom 0.305: v66.17,27.91 66.17,32.89 64.77,34.29 v33.02,34.29 | v25.4,34.29 25.4,15.24 22.86,12.7 v10.16,12.7
SDA  (via drill 0.3, 0.6)
  Top 0.254: 67.26,25.9 U1.27
  Top 0.305: I2C.D- 10.61,14.79 v11.43,13.97 | v24.13,36.83 v34.29,36.83 | 67.26,25.9 67.26,29.03 v67.72,29.49
  Bottom 0.305: v11.43,13.97 21.59,13.97 22.86,15.24 22.86,35.56 v24.13,36.83 | v34.29,36.83 64.77,36.83 67.31,34.29 67.31,29.97 v67.72,29.49
TX  (via drill 0.6)
  Top 0.254: TR2.3 37.08,16.34 R9.2 | U1.31 | v62.66,28.47 62.76,28.45
  Top 0.305: v36.83,17.53 R9.2 | v57.73,23.06 57.73,27.81 v57.05,28.5 | U1.31 64.03,26.59 63.55,27.08 62.97,27.08 62.76,27.28 62.76,28.45
  Bottom 0.254: 8.15,42.95 JP1.2 | 62.71,28.5 v62.66,28.47
  Bottom 0.305: v57.73,23.06 54.99,20.32 41.91,20.32 39.12,17.53 v36.83,17.53 30.73,17.53 29.21,19.05 29.21,40.31 26.57,42.95 8.15,42.95 | v57.05,28.5 62.71,28.5
UART1_RXD  (via drill 0.6)
  Top 0.254: TR2.2 41.4,14.21 41.4,14.68 42.77,16.05 43.91,16.05 R8.2 45.71,16.09 v45.72,16.1
  Bottom 0.254: v45.72,16.1 48.67,16.1 49.53,15.24 49.53,5.08 BEAGLE.72
UART1_TXD  (via drill 0.6)
  Top 0.254: v45.72,11 45.71,11.01 R6.2 43.93,11 42.49,11 41.34,9.84 TR1.2
  Bottom 0.254: v45.72,11 46.69,11 47.65,10.03 47.65,4.47 BEAGLE.70
VDD_5V  (1 unrouted)
VUSB
  Top 0.406: JP1.4 13.11,48.01 14.07,47.04 14.07,44.67 F1.1

### Text on the board
tPlace: GND | P8 | GND | VUSB | LV_DTR | GND | RX | TX | DTR | CC | ROHS | ICSP | GND | SYS_5V | UART1_TXD | UART1_RXD | GND | GND | P9